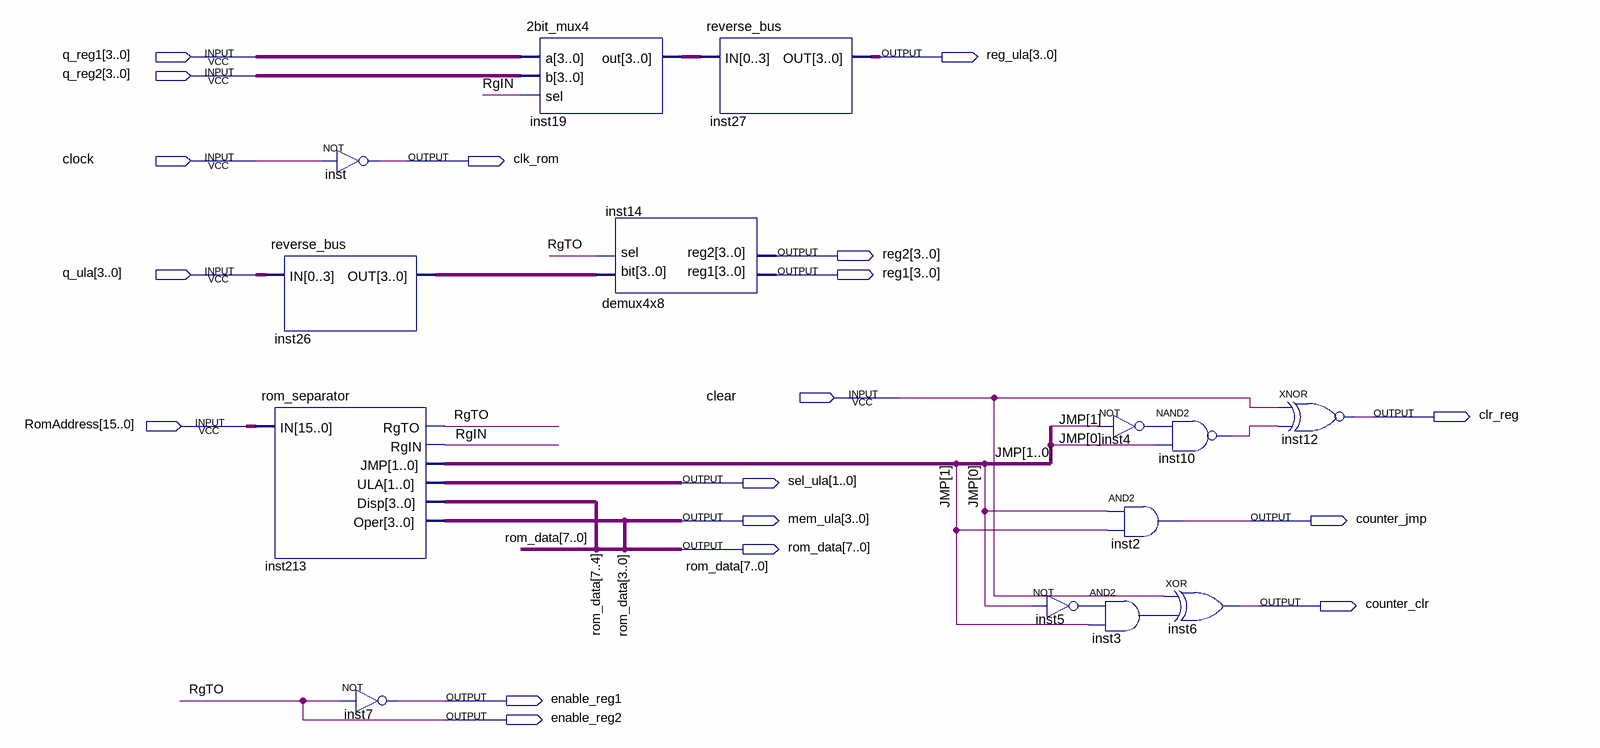
[diagram p0: schematic sheet]
// Quartus schematic uc_f.bdf as structural Verilog: 14 symbols, 18 pins
module uc_f (
  input  [3:0] q_reg1,
  input  [3:0] q_reg2,
  input  clock,
  input  [3:0] q_ula,
  input  clear,
  input  [15:0] RomAddress,
  output [3:0] reg_ula,
  output clk_rom,
  output [3:0] reg2,
  output [3:0] reg1,
  output clr_reg,
  output [1:0] sel_ula,
  output [3:0] mem_ula,
  output counter_jmp,
  output [7:0] rom_data,
  output counter_clr,
  output enable_reg1,
  output enable_reg2
);

  wire inst3_out, inst4_out, inst5_out, inst10_out, RgIN;
  wire [1:0] JMP;
  wire [3:0] inst19_out, inst26_out;

  reverse_bus inst26 (.IN(q_ula), .OUT(inst26_out));
  rom_separator inst213 (
    .IN(RomAddress), .RgTO(enable_reg2), .RgIN(RgIN), .JMP(JMP), .ULA(sel_ula), .Disp(rom_data[7:4]),
    .Oper(mem_ula));
  not inst (clk_rom, clock);
  not inst7 (enable_reg1, enable_reg2);
  \2bit_mux4  inst19 (.a(q_reg1), .b(q_reg2), .sel(RgIN), .out(inst19_out));
  demux4x8 inst14 (.\bit (inst26_out), .sel(enable_reg2), .reg1(reg1), .reg2(reg2));
  reverse_bus inst27 (.IN(inst19_out), .OUT(reg_ula));
  not inst5 (inst5_out, JMP[0]);
  not inst4 (inst4_out, JMP[1]);
  and inst2 (counter_jmp, JMP[0], JMP[1]);
  and inst3 (inst3_out, inst5_out, JMP[1]);
  nand inst10 (inst10_out, inst4_out, JMP[0]);
  xor inst6 (counter_clr, clear, inst3_out);
  xnor inst12 (clr_reg, clear, inst10_out);

  assign rom_data[3:0] = mem_ula;

  // Other names for the same wires on the sheet: RgTO = enable_reg2
endmodule
